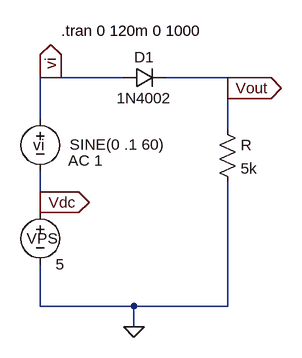
[diagram p0: schematic exam1_11_ac_transient.asc]
exam1_11_ac_transient.asc, the LTspice schematic file:
Version 4
SHEET 1 880 680
WIRE 48 64 32 64
WIRE 160 64 48 64
WIRE 320 64 224 64
WIRE 320 80 320 64
WIRE 32 128 32 64
WIRE 320 144 320 80
WIRE 32 256 32 208
WIRE 32 272 32 256
WIRE 32 416 32 352
WIRE 176 416 32 416
WIRE 320 416 320 224
WIRE 320 416 176 416
WIRE 176 448 176 416
FLAG 176 448 0
FLAG 320 80 Vout
IOPIN 320 80 Out
FLAG 48 64 vi
IOPIN 48 64 Out
FLAG 32 256 Vdc
IOPIN 32 256 Out
SYMBOL diode 160 80 R270
WINDOW 0 32 32 VTop 2
WINDOW 3 0 32 VBottom 2
SYMATTR InstName D1
SYMATTR Value 1N4002
SYMBOL res 304 128 R0
SYMATTR InstName R
SYMATTR Value 5k
SYMBOL voltage 32 256 R0
WINDOW 0 -21 56 Left 2
SYMATTR InstName VPS
SYMATTR Value 5
SYMBOL voltage 32 112 R0
WINDOW 0 -11 56 Left 2
WINDOW 3 45 55 Left 2
WINDOW 123 43 80 Left 2
WINDOW 39 0 0 Left 0
SYMATTR InstName vi
SYMATTR Value SINE(0 .1 60)
SYMATTR Value2 AC 1
TEXT 64 -8 Left 2 !.tran 0 120m 0 1000

The netlist it stands for:
* exam1_11_ac_transient.asc
D1 vi Vout 1N4002
R Vout 0 5k
VPS Vdc 0 5
vi vi Vdc SINE(0 .1 60) AC 1
.model D D
.lib standard.dio
.tran 0 120m 0 1000
.backanno
.end

* Results of the author's LTspice run, read from the files saved beside the schematic
* Operating Point, zero values left out:
*   V(vi) = 5 V
*   V(vout) = 4.432 V
*   V(vdc) = 5 V
*   I(D1) = 886.4 µA
*   I(R) = 886.4 µA
*   I(Vps) = -886.4 µA
*   I(Vi) = -886.4 µA
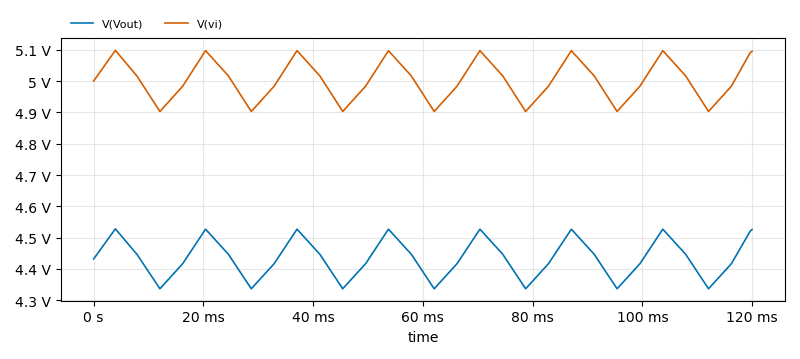
[diagram p1: Transient Analysis of exam1_11_ac_transient.asc, plotted from the saved traces]
* Transient Analysis, 1 run:
*   V(Vout): min 4.337 V, max 4.528 V, average 4.433 V, rms 4.434 V, last 4.526 V
*   V(vi): min 4.903 V, max 5.098 V, average 5.001 V, rms 5.002 V, last 5.095 V